# Altium project Water System.PrjPcb
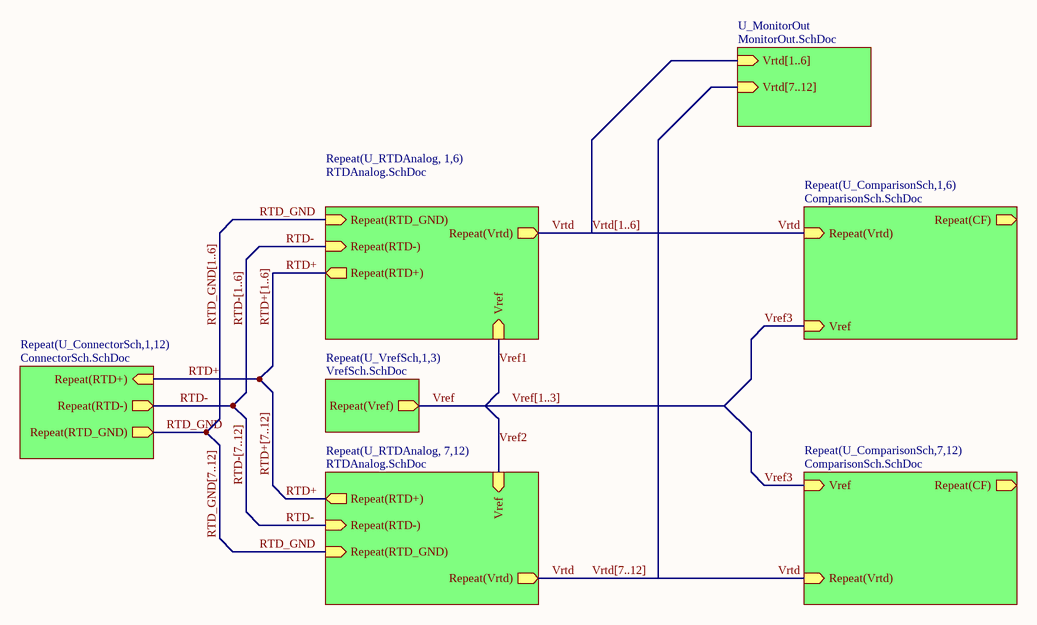
[diagram p0: MainSch.SchDoc]
7 sheets, 170 parts. Net scope: hierarchical (ports join the sheet entries above them; power ports are global).
Sheets:
  MainSch.SchDoc
    U_RTDAnalog1 = RTDAnalog.SchDoc
    U_RTDAnalog2 = RTDAnalog.SchDoc
    U_RTDAnalog3 = RTDAnalog.SchDoc
    U_RTDAnalog4 = RTDAnalog.SchDoc
    U_RTDAnalog5 = RTDAnalog.SchDoc
    U_RTDAnalog6 = RTDAnalog.SchDoc
    U_VrefSch1 = VrefSch.SchDoc
    U_VrefSch2 = VrefSch.SchDoc
    U_VrefSch3 = VrefSch.SchDoc
    U_RTDAnalog7 = RTDAnalog.SchDoc
    U_RTDAnalog8 = RTDAnalog.SchDoc
    U_RTDAnalog9 = RTDAnalog.SchDoc
    U_RTDAnalog10 = RTDAnalog.SchDoc
    U_RTDAnalog11 = RTDAnalog.SchDoc
    U_RTDAnalog12 = RTDAnalog.SchDoc
    U_ConnectorSch1 = ConnectorSch.SchDoc
    U_ConnectorSch2 = ConnectorSch.SchDoc
    U_ConnectorSch3 = ConnectorSch.SchDoc
    U_ConnectorSch4 = ConnectorSch.SchDoc
    U_ConnectorSch5 = ConnectorSch.SchDoc
    U_ConnectorSch6 = ConnectorSch.SchDoc
    U_ConnectorSch7 = ConnectorSch.SchDoc
    U_ConnectorSch8 = ConnectorSch.SchDoc
    U_ConnectorSch9 = ConnectorSch.SchDoc
    U_ConnectorSch10 = ConnectorSch.SchDoc
    U_ConnectorSch11 = ConnectorSch.SchDoc
    U_ConnectorSch12 = ConnectorSch.SchDoc
    U_ComparisonSch1 = ComparisonSch.SchDoc
    U_ComparisonSch2 = ComparisonSch.SchDoc
    U_ComparisonSch3 = ComparisonSch.SchDoc
    U_ComparisonSch4 = ComparisonSch.SchDoc
    U_ComparisonSch5 = ComparisonSch.SchDoc
    U_ComparisonSch6 = ComparisonSch.SchDoc
    U_ComparisonSch7 = ComparisonSch.SchDoc
    U_ComparisonSch8 = ComparisonSch.SchDoc
    U_ComparisonSch9 = ComparisonSch.SchDoc
    U_ComparisonSch10 = ComparisonSch.SchDoc
    U_ComparisonSch11 = ComparisonSch.SchDoc
    U_ComparisonSch12 = ComparisonSch.SchDoc
    U_MonitorOut = MonitorOut.SchDoc
  12VSupply.SchDoc

## Sheet MainSch.SchDoc
size A

### Sub-sheets
Repeat(U_ComparisonSch,1,6) = ComparisonSch.SchDoc: Vref (in), Repeat(Vrtd) (in), Repeat(CF) (out)
Repeat(U_ComparisonSch,7,12) = ComparisonSch.SchDoc: Vref (in), Repeat(Vrtd) (in), Repeat(CF) (out)
Repeat(U_ConnectorSch,1,12) = ConnectorSch.SchDoc: Repeat(RTD+) (in), Repeat(RTD-) (out), Repeat(RTD_GND) (out)
Repeat(U_RTDAnalog, 1,6) = RTDAnalog.SchDoc: Repeat(RTD+) (out), Vref (in), Repeat(RTD_GND) (in), Repeat(Vrtd) (out), Repeat(RTD-) (in)
Repeat(U_RTDAnalog, 7,12) = RTDAnalog.SchDoc: Repeat(RTD+) (out), Vref (in), Repeat(RTD_GND) (in), Repeat(Vrtd) (out), Repeat(RTD-) (in)
Repeat(U_VrefSch,1,3) = VrefSch.SchDoc: Repeat(Vref) (out)
U_MonitorOut = MonitorOut.SchDoc: Vrtd[1..6] (in), Vrtd[7..12] (in)

### Nets
RTD+: sheet Repeat(U_RTDAnalog, 1,6)/Repeat(RTD+), sheet Repeat(U_RTDAnalog, 7,12)/Repeat(RTD+), sheet Repeat(U_ConnectorSch,1,12)/Repeat(RTD+)
RTD-: sheet Repeat(U_RTDAnalog, 1,6)/Repeat(RTD-), sheet Repeat(U_RTDAnalog, 7,12)/Repeat(RTD-), sheet Repeat(U_ConnectorSch,1,12)/Repeat(RTD-)
RTD_GND: sheet Repeat(U_RTDAnalog, 1,6)/Repeat(RTD_GND), sheet Repeat(U_RTDAnalog, 7,12)/Repeat(RTD_GND), sheet Repeat(U_ConnectorSch,1,12)/Repeat(RTD_GND)  [also labelled RTD_GND[7..12]]
Vref: sheet Repeat(U_VrefSch,1,3)/Repeat(Vref)
Vref3: sheet Repeat(U_ComparisonSch,1,6)/Vref, sheet Repeat(U_ComparisonSch,7,12)/Vref
Vrtd: sheet Repeat(U_RTDAnalog, 1,6)/Repeat(Vrtd), sheet Repeat(U_RTDAnalog, 7,12)/Repeat(Vrtd), sheet Repeat(U_ComparisonSch,1,6)/Repeat(Vrtd), sheet Repeat(U_ComparisonSch,7,12)/Repeat(Vrtd)

### Buses and harness runs
bus RTD+[1..6]
bus RTD+[7..12]
bus RTD-[1..6]
bus RTD-[7..12]
bus RTD_GND[1..6]
bus Vref[1..3]
bus Vrtd[1..6] = sheet U_MonitorOut/Vrtd[1..6]
bus Vrtd[7..12] = sheet U_MonitorOut/Vrtd[7..12]

## Sheet RTDAnalog.SchDoc
size A
Used 12 times, as channels U_RTDAnalog1, U_RTDAnalog2, U_RTDAnalog3, U_RTDAnalog4, U_RTDAnalog5, U_RTDAnalog6, U_RTDAnalog7, U_RTDAnalog8, U_RTDAnalog9, U_RTDAnalog10, U_RTDAnalog11, U_RTDAnalog12. Parts and nets are listed once, with the designators drawn on the sheet.
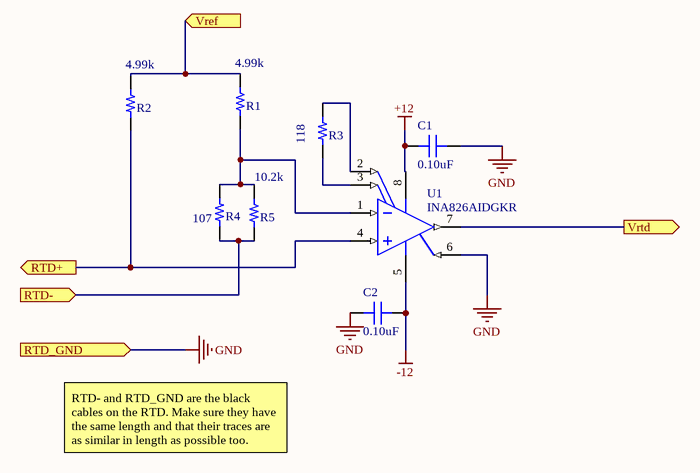
[diagram p1: RTDAnalog.SchDoc]

### Parts
C1  0.10uF  [CAP 0402/1005]
C2  0.10uF  [CAP 0402/1005]
R1  4.99k  [RES 0805/2012]
R2  4.99k  [RES 0805/2012]
R3  118  [RES 0805/2012]
R4  107  [RES 0805/2012]
R5  10.2k  [RES 0805/2012]
U1  INA826AIDGKR  [DGK0008A_N]

### Ports
RTD+ (out), RTD- (in), RTD_GND (in), Vref (in), Vrtd (out)

### Nets
+12: C1.1 U1.8(VS+)
-12: C2.2 U1.5(VS-)
GND: C1.2 C2.1 U1.6(REF) ; port RTD_GND
RTD+: R2.1 U1.4(IN+) ; port RTD+
RTD-: R4.1 R5.1 ; port RTD-
Vref: R1.2 R2.2 ; port Vref
Vrtd: U1.7(VOUT) ; port Vrtd
NetR1_1: R1.1 R4.2 R5.2 U1.1(IN-)
NetR3_1: R3.1 U1.3(RG)
NetR3_2: R3.2 U1.2(RG)

### Channels
U_RTDAnalog1: designators end in _U_RTDAnalog1; ports RTD+=RTD+1 RTD-=RTD-1 RTD_GND=RTD_GND1 Vref=Vref1 Vrtd=Vrtd1
U_RTDAnalog2: designators end in _U_RTDAnalog2; ports RTD+=RTD+2 RTD-=RTD-2 RTD_GND=RTD_GND1 Vref=Vref1 Vrtd=Vrtd2
U_RTDAnalog3: designators end in _U_RTDAnalog3; ports RTD+=RTD+3 RTD-=RTD-3 RTD_GND=RTD_GND1 Vref=Vref1 Vrtd=Vrtd3
U_RTDAnalog4: designators end in _U_RTDAnalog4; ports RTD+=RTD+4 RTD-=RTD-4 RTD_GND=RTD_GND1 Vref=Vref1 Vrtd=Vrtd4
U_RTDAnalog5: designators end in _U_RTDAnalog5; ports RTD+=RTD+5 RTD-=RTD-5 RTD_GND=RTD_GND1 Vref=Vref1 Vrtd=Vrtd5
U_RTDAnalog6: designators end in _U_RTDAnalog6; ports RTD+=RTD+6 RTD-=RTD-6 RTD_GND=RTD_GND1 Vref=Vref1 Vrtd=Vrtd6
U_RTDAnalog7: designators end in _U_RTDAnalog7; ports RTD+=RTD+7 RTD-=RTD-7 RTD_GND=RTD_GND1 Vref=Vref2 Vrtd=Vrtd7
U_RTDAnalog8: designators end in _U_RTDAnalog8; ports RTD+=RTD+8 RTD-=RTD-8 RTD_GND=RTD_GND1 Vref=Vref2 Vrtd=Vrtd8
U_RTDAnalog9: designators end in _U_RTDAnalog9; ports RTD+=RTD+9 RTD-=RTD-9 RTD_GND=RTD_GND1 Vref=Vref2 Vrtd=Vrtd9
U_RTDAnalog10: designators end in _U_RTDAnalog10; ports RTD+=RTD+10 RTD-=RTD-10 RTD_GND=RTD_GND1 Vref=Vref2 Vrtd=Vrtd10
U_RTDAnalog11: designators end in _U_RTDAnalog11; ports RTD+=RTD+11 RTD-=RTD-11 RTD_GND=RTD_GND1 Vref=Vref2 Vrtd=Vrtd11
U_RTDAnalog12: designators end in _U_RTDAnalog12; ports RTD+=RTD+12 RTD-=RTD-12 RTD_GND=RTD_GND1 Vref=Vref2 Vrtd=Vrtd12

### Notes on the sheet
- RTD- and RTD_GND are the black cables on the RTD. Make sure they have the same length and that their traces are as similar in length as possible too.

### Library data of the parts
C1 C2 = GRM155R71C104JA88D: CAP CER 0.1UF 16V X7R 0402; Manufacturer: Murata Electronics North America; TemperatureRange: -55C ~ 125C; Tolerance: 5%; Value: 0.10uF; Part Number: GRM155R71C104JA88D; PartId: 12366; Supplier 1: Digi-Key; Supplier Part Number 1: 490-6327-2-ND; ComponentLink1Description: Datasheet; ComponentLink1URL: http://www.murata.com/~/media/webrenewal/support/library/catalog/products/capacitor/mlcc/c02e.pdf; ComponentLink2Description: Digi-Key Listing; ComponentLink2URL: https://www.digikey.com/product-detail/en/murata-electronics-north-america/GRM155R71C104JA88D/490-6327-2-ND/2610891; TemperatureCoefficient: X7R; Voltage: 16V; Price: 0.0046; Device Package: 0402 (1005 Metric)
R1 R2 = ERA-6AEB4991V: RES SMD 4.99K OHM 0.1% 1/8W 0805; Manufacturer: Panasonic Electronic Components; TemperatureRange: -55C ~ 155C; TemperatureCoefficient: 25ppm/C; PowerRating: 0.125W, 1/8W; Value: 4.99k; Part Number: ERA-6AEB4991V; PartId: 2457; Supplier 1: Digi-Key; Supplier Part Number 1: P4.99KDATR-ND; ComponentLink1Description: Datasheet; ComponentLink1URL: http://industrial.panasonic.com/lecs/www-data/pdf/AOA0000/AOA0000CE26.pdf; ComponentLink2Description: Digi-Key listing; ComponentLink2URL: http://digikey.com/product-detail/en/ERA-6AEB4991V/P4.99KDATR-ND/2025726; Tolerance: 0.1%; Price: 0.0653; Type: Thin Film; Device Package: 0805 (2012 Metric)
R3 = ERA-6AEB1180V: RES SMD 118 OHM 0.1% 1/8W 0805; Manufacturer: Panasonic Electronic Components; TemperatureRange: -55C ~ 155C; TemperatureCoefficient: 25ppm/C; PowerRating: 0.125W, 1/8W; Value: 118; Part Number: ERA-6AEB1180V; PartId: 2788; Supplier 1: Digi-Key; Supplier Part Number 1: P118DATR-ND; ComponentLink1Description: Datasheet; ComponentLink1URL: http://industrial.panasonic.com/lecs/www-data/pdf/AOA0000/AOA0000CE26.pdf; ComponentLink2Description: Digi-Key listing; ComponentLink2URL: http://digikey.com/product-detail/en/ERA-6AEB1180V/P118DATR-ND/2025579; Tolerance: 0.1%; Price: 0.0653; Type: Thin Film; Device Package: 0805 (2012 Metric)
R4 = ERA-6AEB1070V: RES SMD 107 OHM 0.1% 1/8W 0805; Manufacturer: Panasonic Electronic Components; TemperatureRange: -55C ~ 155C; TemperatureCoefficient: 25ppm/C; PowerRating: 0.125W, 1/8W; Value: 107; Part Number: ERA-6AEB1070V; PartId: 2810; Supplier 1: Digi-Key; Supplier Part Number 1: P107DATR-ND; ComponentLink1Description: Datasheet; ComponentLink1URL: http://industrial.panasonic.com/lecs/www-data/pdf/AOA0000/AOA0000CE26.pdf; ComponentLink2Description: Digi-Key listing; ComponentLink2URL: http://digikey.com/product-detail/en/ERA-6AEB1070V/P107DATR-ND/2025576; Tolerance: 0.1%; Price: 0.0653; Type: Thin Film; Device Package: 0805 (2012 Metric)
R5 = ERA-6AEB1022V: RES SMD 10.2K OHM 0.1% 1/8W 0805; Manufacturer: Panasonic Electronic Components; TemperatureRange: -55C ~ 155C; TemperatureCoefficient: 25ppm/C; PowerRating: 0.125W, 1/8W; Value: 10.2k; Part Number: ERA-6AEB1022V; PartId: 2668; Supplier 1: Digi-Key; Supplier Part Number 1: P10.2KDATR-ND; ComponentLink1Description: Datasheet; ComponentLink1URL: http://industrial.panasonic.com/lecs/www-data/pdf/AOA0000/AOA0000CE26.pdf; ComponentLink2Description: Digi-Key listing; ComponentLink2URL: http://digikey.com/product-detail/en/ERA-6AEB1022V/P10.2KDATR-ND/2025754; Tolerance: 0.1%; Price: 0.0653; Type: Thin Film; Device Package: 0805 (2012 Metric)
U1 = CMP-0944-00060-2: Precision, 200-uA Supply Current, 36-V Supply Instrumentation Amplifier, -40 to 125 degC, 8-pin SOP (DGK8), Green (RoHS & no Sb/Br); Manufacturer: Texas Instruments; Output Offset (+/-)(Max)(uV): 700; Input Offset Drift (+/-)(Max)(uV/Degrees Celsius): 2; Vs(Max)(V): 36; Non-Linearity (+/-)(Max)(%): 0.0005; Input Offset (+/-)(Max)(uV): 150; Output Offset Drift (+/-)(Max)(uV/Degrees Celsius): 10; Gain(V/V): 1 to 1000; CMRR(Min)(dB): 84; Noise at 1kHz(Typ)(nV/rt(Hz)): 18; Vs(Min)(V): 2.7; SubFamily: Single Supply; Number of Channels: 1; Input Bias Current (+/-)(Max)(nA): 65; Quiescent Current (+/-)(Typ)(mA): 0.2; ComponentLink1Description: Manufacturer URL; PartNumber: INA826AIDGKR; ComponentLink2URL: http://www.ti.com/general/docs/lit/getliterature.tsp?genericPartNumber=INA826&fileType=pdf; Code_JEDEC: MO-187; Eco-Plan: Green (RoHS & no Sb/Br); ComponentLink3URL: http://www.ti.com/litv/pdf/mpds028d; Mounting Technology: Surface Mount; ComponentLink3Description: Package Specification; PackageReference: DGK0008A; ComponentLink2Description: Datasheet; DatasheetVersion: SBOS562E; ComponentLink1URL: http://www.ti.com/; PackageDescription: 8-Pin Thin Small Outline, Body 3 x 3 mm, Pitch 0.65 mm; PackageVersion: 4073329/E, 05/2006

## Sheet VrefSch.SchDoc
size A
Used 3 times, as channels U_VrefSch1, U_VrefSch2, U_VrefSch3. Parts and nets are listed once, with the designators drawn on the sheet.
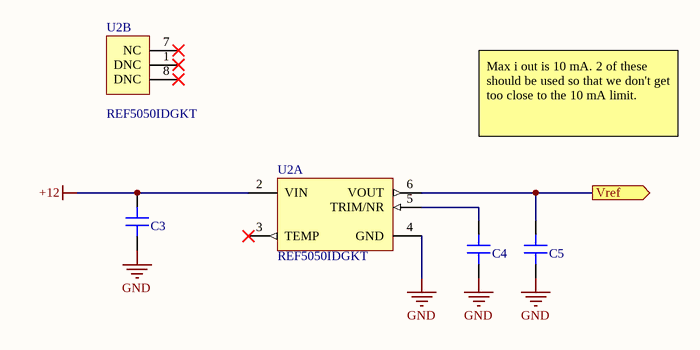
[diagram p2: VrefSch.SchDoc]

### Parts
C3  1uF  [CAP 0805/2012]  (value not drawn)
C4  1uF  [CAP 0805/2012]  (value not drawn)
C5  1uF  [CAP 0805/2012]  (value not drawn)
U2  REF5050IDGKT  [DGK0008A_N]  (parts A,B of 2)

### Ports
Vref (out)

### Nets
+12: C3.2 U2.2(VIN)
GND: C3.1 C4.1 C5.1 U2.4(GND)
Vref: C5.2 U2.6(VOUT) ; port Vref
NetC4_2: C4.2 U2.5(TRIM/NR)

Not connected (* = marked no-connect by the designer): U2 1(DNC)* 3(TEMP)* 7(NC)* 8(DNC)*

### Channels
U_VrefSch1: designators end in _U_VrefSch1; ports Vref=Vref1
U_VrefSch2: designators end in _U_VrefSch2; ports Vref=Vref2
U_VrefSch3: designators end in _U_VrefSch3; ports Vref=Vref3

### Notes on the sheet
- Max i out is 10 mA. 2 of these should be used so that we don't get too close to the 10 mA limit.

### Library data of the parts
C3-C5 = C0805C105J3RACTU: CAP CER 1UF 25V X7R 0805; Manufacturer: Kemet; TemperatureRange: -55C ~ 125C; Tolerance: 5%; Value: 1uF; Part Number: C0805C105J3RACTU; PartId: 6145; Supplier 1: Digi-Key; Supplier Part Number 1: 399-10060-2-ND; ComponentLink1Description: Datasheet; ComponentLink1URL: http://www.kemet.com/docfinder?Partnumber=C0805C105J3RACTU; ComponentLink2Description: Digi-Key listing; ComponentLink2URL: http://digikey.com/product-detail/en/C0805C105J3RACTU/399-10060-2-ND/2211758; TemperatureCoefficient: X7R; Voltage: 25V; Price: 0.355; Type: -; Device Package: 0805 (2012 Metric)
U2 = CMP-0367-00254-2: Low Noise, Very Low Drift, Precision Voltage Reference, -40 to 125 degC, 8-pin VSSOP (DGK), Green (RoHS & no Sb/Br); Manufacturer: Texas Instruments; VI(Min)(V): 5.2; Rating: Catalog; Initial Accuracy @ 25/deg C(%): 0.05; VO(V): 5; Iq(Max)(uA): 1000; SubFamily: Series Voltage Reference; Temp Coeff(Max)(ppm/ degree C): 3; Iout/Iz(Max)(mA): 10; VI(Max)(V): 18; ComponentLink1Description: Manufacturer URL; PartNumber: REF5050IDGKT; PackageVersion: 4073329/E; Code_JEDEC: MO-187; Eco-Plan: Green (RoHS & no Sb/Br); ComponentLink2Description: Datasheet; PackageReference: DGK0008A; ComponentLink2URL: http://www.ti.com/general/docs/lit/getliterature.tsp?genericPartNumber=REF5050&fileType=pdf; ComponentLink3URL: http://www.ti.com/litv/pdf/mpds028d; ComponentLink1URL: http://www.ti.com/; PackageDescription: 8-Pin Thin Small Outline Package 3 x 3 mm Body ,0.65 mm Pitch; ComponentLink3Description: Package Specification; Mounting Technology: Surface Mount; DatasheetVersion: SBOS410E

## Sheet ConnectorSch.SchDoc
size A
Used 12 times, as channels U_ConnectorSch1, U_ConnectorSch2, U_ConnectorSch3, U_ConnectorSch4, U_ConnectorSch5, U_ConnectorSch6, U_ConnectorSch7, U_ConnectorSch8, U_ConnectorSch9, U_ConnectorSch10, U_ConnectorSch11, U_ConnectorSch12. Parts and nets are listed once, with the designators drawn on the sheet.
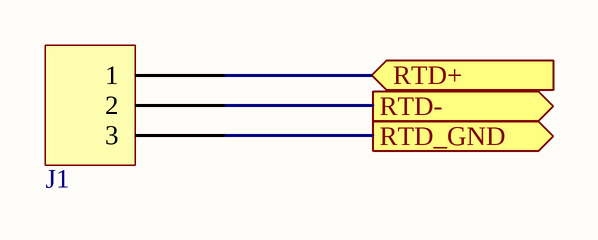
[diagram p3: ConnectorSch.SchDoc]

### Parts
J1  0022272031  [MOLEX KK 0022272031]  (value not drawn)

### Ports
RTD+ (in), RTD- (out), RTD_GND (out)

### Nets
RTD+: J1.1 ; port RTD+
RTD-: J1.2 ; port RTD-
RTD_GND: J1.3 ; port RTD_GND

### Channels
U_ConnectorSch1: designators end in _U_ConnectorSch1; ports RTD+=RTD+1 RTD-=RTD-1 RTD_GND=RTD_GND1
U_ConnectorSch2: designators end in _U_ConnectorSch2; ports RTD+=RTD+2 RTD-=RTD-2 RTD_GND=RTD_GND1
U_ConnectorSch3: designators end in _U_ConnectorSch3; ports RTD+=RTD+3 RTD-=RTD-3 RTD_GND=RTD_GND1
U_ConnectorSch4: designators end in _U_ConnectorSch4; ports RTD+=RTD+4 RTD-=RTD-4 RTD_GND=RTD_GND1
U_ConnectorSch5: designators end in _U_ConnectorSch5; ports RTD+=RTD+5 RTD-=RTD-5 RTD_GND=RTD_GND1
U_ConnectorSch6: designators end in _U_ConnectorSch6; ports RTD+=RTD+6 RTD-=RTD-6 RTD_GND=RTD_GND1
U_ConnectorSch7: designators end in _U_ConnectorSch7; ports RTD+=RTD+7 RTD-=RTD-7 RTD_GND=RTD_GND1
U_ConnectorSch8: designators end in _U_ConnectorSch8; ports RTD+=RTD+8 RTD-=RTD-8 RTD_GND=RTD_GND1
U_ConnectorSch9: designators end in _U_ConnectorSch9; ports RTD+=RTD+9 RTD-=RTD-9 RTD_GND=RTD_GND1
U_ConnectorSch10: designators end in _U_ConnectorSch10; ports RTD+=RTD+10 RTD-=RTD-10 RTD_GND=RTD_GND1
U_ConnectorSch11: designators end in _U_ConnectorSch11; ports RTD+=RTD+11 RTD-=RTD-11 RTD_GND=RTD_GND1
U_ConnectorSch12: designators end in _U_ConnectorSch12; ports RTD+=RTD+12 RTD-=RTD-12 RTD_GND=RTD_GND1

### Library data of the parts
J1 = 0022272031: CONN HEADER 3POS .100 VERT TIN; Manufacturer: Molex, LLC; Pitch: 0.100" (2.54mm); Number Of Positions: 3; Part Number: 0022272031; PartId: 9720; Supplier 1: Digi-Key; Supplier Part Number 1: WM4112-ND; ComponentLink1Description: Datasheet; ComponentLink1URL: http://www.molex.com/pdm_docs/sd/022272031_sd.pdf; ComponentLink2Description: Digi-Key Listing; ComponentLink2URL: http://www.digikey.com/product-search/en?keywords=22-27-2031; Price: 0.35; Type: Header, Unshrouded; Contact Finish: Tin; Fastening Type: Friction Lock; Number Of Rows: 1; Colour: Natural; Series: KK 6410

## Sheet ComparisonSch.SchDoc
size A
Used 12 times, as channels U_ComparisonSch1, U_ComparisonSch2, U_ComparisonSch3, U_ComparisonSch4, U_ComparisonSch5, U_ComparisonSch6, U_ComparisonSch7, U_ComparisonSch8, U_ComparisonSch9, U_ComparisonSch10, U_ComparisonSch11, U_ComparisonSch12. Parts and nets are listed once, with the designators drawn on the sheet.
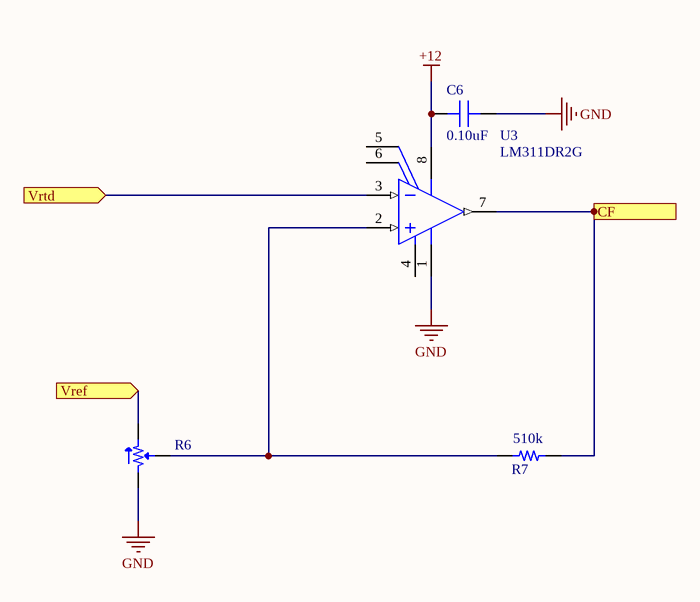
[diagram p4: ComparisonSch.SchDoc]

### Parts
C6  0.10uF  [CAP 0402/1005]
R6  20k  [POT MODEL91A]  (value not drawn)
R7  510k  [RES 1206/3216]
U3  LM311DR2G  [ONSC-SOIC-8-751-07_V]

### Ports
CF (out), Vref (in), Vrtd (in)

### Nets
+12: C6.1 U3.8(VCC)
GND: C6.2 R6.1 U3.1(GND)
CF: R7.2 U3.7(OUT) ; port CF
Vref: R6.3 ; port Vref
Vrtd: U3.3(IN-) ; port Vrtd
NetR6_2: R6.2 R7.1 U3.2(IN+)

Not connected (* = marked no-connect by the designer): U3 4(VEE) 5(BALANCE) 6(BALANCE/STROBE)

### Channels
U_ComparisonSch1: designators end in _U_ComparisonSch1; ports CF=NetR7_U_ComparisonSch1_2 Vref=Vref3 Vrtd=Vrtd1
U_ComparisonSch2: designators end in _U_ComparisonSch2; ports CF=NetR7_U_ComparisonSch2_2 Vref=Vref3 Vrtd=Vrtd2
U_ComparisonSch3: designators end in _U_ComparisonSch3; ports CF=NetR7_U_ComparisonSch3_2 Vref=Vref3 Vrtd=Vrtd3
U_ComparisonSch4: designators end in _U_ComparisonSch4; ports CF=NetR7_U_ComparisonSch4_2 Vref=Vref3 Vrtd=Vrtd4
U_ComparisonSch5: designators end in _U_ComparisonSch5; ports CF=NetR7_U_ComparisonSch5_2 Vref=Vref3 Vrtd=Vrtd5
U_ComparisonSch6: designators end in _U_ComparisonSch6; ports CF=NetR7_U_ComparisonSch6_2 Vref=Vref3 Vrtd=Vrtd6
U_ComparisonSch7: designators end in _U_ComparisonSch7; ports CF=NetR7_U_ComparisonSch7_2 Vref=Vref3 Vrtd=Vrtd7
U_ComparisonSch8: designators end in _U_ComparisonSch8; ports CF=NetR7_U_ComparisonSch8_2 Vref=Vref3 Vrtd=Vrtd8
U_ComparisonSch9: designators end in _U_ComparisonSch9; ports CF=NetR7_U_ComparisonSch9_2 Vref=Vref3 Vrtd=Vrtd9
U_ComparisonSch10: designators end in _U_ComparisonSch10; ports CF=NetR7_U_ComparisonSch10_2 Vref=Vref3 Vrtd=Vrtd10
U_ComparisonSch11: designators end in _U_ComparisonSch11; ports CF=NetR7_U_ComparisonSch11_2 Vref=Vref3 Vrtd=Vrtd11
U_ComparisonSch12: designators end in _U_ComparisonSch12; ports CF=NetR7_U_ComparisonSch12_2 Vref=Vref3 Vrtd=Vrtd12

### Library data of the parts
C6 = GRM155R71C104JA88D: as C1 on sheet RTDAnalog; Value: 0.10uF; Part Number: GRM155R71C104JA88D; PartId: 12366; Supplier 1: Digi-Key; Supplier Part Number 1: 490-6327-2-ND; ComponentLink1Description: Datasheet; ComponentLink1URL: http://www.murata.com/~/media/webrenewal/support/library/catalog/products/capacitor/mlcc/c02e.pdf; ComponentLink2Description: Digi-Key Listing; ComponentLink2URL: https://www.digikey.com/product-detail/en/murata-electronics-north-america/GRM155R71C104JA88D/490-6327-2-ND/2610891; TemperatureCoefficient: X7R; Voltage: 16V; Price: 0.0046; Device Package: 0402 (1005 Metric)
R6 = 91AR20KLF: TRIMMER 20K OHM 3/8" CERMET TH; Manufacturer: TT Electronics/BI; Tolerance: 20%; PowerRating: 0.5W, 1/2W; Number Of Turns: Single; Adjustment Type: Top Adjustment; Value: 20k; Part Number: 91AR20KLF; PartId: 7167; Supplier 1: Digi-Key; Supplier Part Number 1: 987-1170-ND; ComponentLink1Description: Datasheet; ComponentLink1URL: http://www.bitechnologies.com/pdfs/91.pdf; ComponentLink2Description: Digi-Key Listing; ComponentLink2URL: http://www.digikey.ca/product-detail/en/91AR20KLF/987-1170-ND/2408748; Price: 2.25; Type: Through Hole
R7 = ERJ-8GEYJ514V: RES SMD 510K OHM 5% 1/4W 1206; Manufacturer: Panasonic Electronic Components; TemperatureRange: -55C ~ 155C; TemperatureCoefficient: 200ppm/C; PowerRating: 0.25W, 1/4W; Value: 510k; Part Number: ERJ-8GEYJ514V; PartId: 11855; Supplier 1: Digi-Key; Supplier Part Number 1: P510KETR-ND; ComponentLink1Description: Datasheet; ComponentLink1URL: http://industrial.panasonic.com/www-cgi/jvcr13pz.cgi?E+PZ+3+AOA0001+ERJ8GEYJ514V+7+WW; ComponentLink2Description: Digi-Key Listing; ComponentLink2URL: https://www.digikey.com/product-detail/en/panasonic-electronic-components/ERJ-8GEYJ514V/P510KETR-ND/21336; Tolerance: 5%; Price: 0.0045; Device Package: 1206 (3216 Metric)
U3 = CMP-1305-00058-1: Single Comparator, 5 to 30 V, 0 to 70 degC, 8-Pin SOIC, Pb-Free, Tape and Reel; Manufacturer: On Semiconductor; VCC Max (V): 30; VCC Min (V): 5; ICC Typ (mA): 2.4; ComponentLink3Description: Package Specification; ComponentLink1URL: http://www.onsemi.com/; ComponentLink1Description: Manufacturer URL; Mounting Technology: Surface Mount; PackageDescription: 8-Pin Small Outline Integrated Circuit, Body 4.9 x 3.9 mm, Pitch 1.27 mm; ComponentLink2Description: Datasheet; RoHS: TRUE; ComponentLink2URL: http://www.onsemi.com/pub_link/Collateral/LM211-D.PDF; PackageVersion: Rev. AK, 02/2011; PackageReference: SOIC-8-751-07; DatasheetVersion: Rev. 6; Packing: Tape and Reel; ComponentLink3URL: http://www.onsemi.com/pub_link/Collateral/751-07.PDF; PartNumber: LM311DR2G

## Sheet MonitorOut.SchDoc
size A
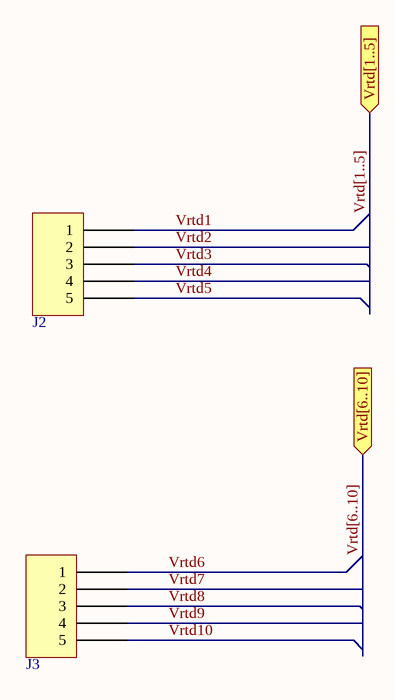
[diagram p5: MonitorOut.SchDoc]

### Parts
J2  0022272051  [MOLEX KK 0022272051]  (value not drawn)
J3  0022272051  [MOLEX KK 0022272051]  (value not drawn)

### Ports
Vrtd[1..5] (in), Vrtd[6..10] (in)

### Nets
Vrtd1: J2.1  [also labelled Vrtd[1..5]]
Vrtd2: J2.2
Vrtd3: J2.3
Vrtd4: J2.4
Vrtd5: J2.5
Vrtd6: J3.1  [also labelled Vrtd[6..10]]
Vrtd7: J3.2
Vrtd8: J3.3
Vrtd9: J3.4
Vrtd10: J3.5

### Library data of the parts
J2 J3 = 0022272051: CONN HEADER 5POS .100 VERT TIN; Manufacturer: Molex, LLC; Pitch: 0.100" (2.54mm); Number Of Positions: 5; Part Number: 0022272051; PartId: 9722; Supplier 1: Digi-Key; Supplier Part Number 1: WM4114-ND; ComponentLink1Description: Datasheet; ComponentLink1URL: http://www.molex.com/pdm_docs/sd/022272051_sd.pdf; ComponentLink2Description: Digi-Key Listing; ComponentLink2URL: http://www.digikey.com/product-search/en?keywords=22-27-2051; Price: 0.44; Type: Header, Unshrouded; Contact Finish: Tin; Fastening Type: Friction Lock; Number Of Rows: 1; Colour: Natural; Series: KK 6410

## Sheet 12VSupply.SchDoc
size A

## Nets that join several sheets
+12: U_RTDAnalog1 (C1_U_RTDAnalog1.1 U1_U_RTDAnalog1.8), U_RTDAnalog2 (C1_U_RTDAnalog2.1 U1_U_RTDAnalog2.8), U_RTDAnalog3 (C1_U_RTDAnalog3.1 U1_U_RTDAnalog3.8), U_RTDAnalog4 (C1_U_RTDAnalog4.1 U1_U_RTDAnalog4.8), U_RTDAnalog5 (C1_U_RTDAnalog5.1 U1_U_RTDAnalog5.8), U_RTDAnalog6 (C1_U_RTDAnalog6.1 U1_U_RTDAnalog6.8), U_VrefSch1 (C3_U_VrefSch1.2 U2_U_VrefSch1.2), U_VrefSch2 (C3_U_VrefSch2.2 U2_U_VrefSch2.2), U_VrefSch3 (C3_U_VrefSch3.2 U2_U_VrefSch3.2), U_RTDAnalog7 (C1_U_RTDAnalog7.1 U1_U_RTDAnalog7.8), U_RTDAnalog8 (C1_U_RTDAnalog8.1 U1_U_RTDAnalog8.8), U_RTDAnalog9 (C1_U_RTDAnalog9.1 U1_U_RTDAnalog9.8), U_RTDAnalog10 (C1_U_RTDAnalog10.1 U1_U_RTDAnalog10.8), U_RTDAnalog11 (C1_U_RTDAnalog11.1 U1_U_RTDAnalog11.8), U_RTDAnalog12 (C1_U_RTDAnalog12.1 U1_U_RTDAnalog12.8), U_ComparisonSch1 (C6_U_ComparisonSch1.1 U3_U_ComparisonSch1.8), U_ComparisonSch2 (C6_U_ComparisonSch2.1 U3_U_ComparisonSch2.8), U_ComparisonSch3 (C6_U_ComparisonSch3.1 U3_U_ComparisonSch3.8), U_ComparisonSch4 (C6_U_ComparisonSch4.1 U3_U_ComparisonSch4.8), U_ComparisonSch5 (C6_U_ComparisonSch5.1 U3_U_ComparisonSch5.8), U_ComparisonSch6 (C6_U_ComparisonSch6.1 U3_U_ComparisonSch6.8), U_ComparisonSch7 (C6_U_ComparisonSch7.1 U3_U_ComparisonSch7.8), U_ComparisonSch8 (C6_U_ComparisonSch8.1 U3_U_ComparisonSch8.8), U_ComparisonSch9 (C6_U_ComparisonSch9.1 U3_U_ComparisonSch9.8), U_ComparisonSch10 (C6_U_ComparisonSch10.1 U3_U_ComparisonSch10.8), U_ComparisonSch11 (C6_U_ComparisonSch11.1 U3_U_ComparisonSch11.8), U_ComparisonSch12 (C6_U_ComparisonSch12.1 U3_U_ComparisonSch12.8)
-12: U_RTDAnalog1 (C2_U_RTDAnalog1.2 U1_U_RTDAnalog1.5), U_RTDAnalog2 (C2_U_RTDAnalog2.2 U1_U_RTDAnalog2.5), U_RTDAnalog3 (C2_U_RTDAnalog3.2 U1_U_RTDAnalog3.5), U_RTDAnalog4 (C2_U_RTDAnalog4.2 U1_U_RTDAnalog4.5), U_RTDAnalog5 (C2_U_RTDAnalog5.2 U1_U_RTDAnalog5.5), U_RTDAnalog6 (C2_U_RTDAnalog6.2 U1_U_RTDAnalog6.5), U_RTDAnalog7 (C2_U_RTDAnalog7.2 U1_U_RTDAnalog7.5), U_RTDAnalog8 (C2_U_RTDAnalog8.2 U1_U_RTDAnalog8.5), U_RTDAnalog9 (C2_U_RTDAnalog9.2 U1_U_RTDAnalog9.5), U_RTDAnalog10 (C2_U_RTDAnalog10.2 U1_U_RTDAnalog10.5), U_RTDAnalog11 (C2_U_RTDAnalog11.2 U1_U_RTDAnalog11.5), U_RTDAnalog12 (C2_U_RTDAnalog12.2 U1_U_RTDAnalog12.5)
RTD_GND1: U_RTDAnalog1 (C1_U_RTDAnalog1.2 C2_U_RTDAnalog1.1 U1_U_RTDAnalog1.6), U_RTDAnalog2 (C1_U_RTDAnalog2.2 C2_U_RTDAnalog2.1 U1_U_RTDAnalog2.6), U_RTDAnalog3 (C1_U_RTDAnalog3.2 C2_U_RTDAnalog3.1 U1_U_RTDAnalog3.6), U_RTDAnalog4 (C1_U_RTDAnalog4.2 C2_U_RTDAnalog4.1 U1_U_RTDAnalog4.6), U_RTDAnalog5 (C1_U_RTDAnalog5.2 C2_U_RTDAnalog5.1 U1_U_RTDAnalog5.6), U_RTDAnalog6 (C1_U_RTDAnalog6.2 C2_U_RTDAnalog6.1 U1_U_RTDAnalog6.6), U_VrefSch1 (C3_U_VrefSch1.1 C4_U_VrefSch1.1 C5_U_VrefSch1.1 U2_U_VrefSch1.4), U_VrefSch2 (C3_U_VrefSch2.1 C4_U_VrefSch2.1 C5_U_VrefSch2.1 U2_U_VrefSch2.4), U_VrefSch3 (C3_U_VrefSch3.1 C4_U_VrefSch3.1 C5_U_VrefSch3.1 U2_U_VrefSch3.4), U_RTDAnalog7 (C1_U_RTDAnalog7.2 C2_U_RTDAnalog7.1 U1_U_RTDAnalog7.6), U_RTDAnalog8 (C1_U_RTDAnalog8.2 C2_U_RTDAnalog8.1 U1_U_RTDAnalog8.6), U_RTDAnalog9 (C1_U_RTDAnalog9.2 C2_U_RTDAnalog9.1 U1_U_RTDAnalog9.6), U_RTDAnalog10 (C1_U_RTDAnalog10.2 C2_U_RTDAnalog10.1 U1_U_RTDAnalog10.6), U_RTDAnalog11 (C1_U_RTDAnalog11.2 C2_U_RTDAnalog11.1 U1_U_RTDAnalog11.6), U_RTDAnalog12 (C1_U_RTDAnalog12.2 C2_U_RTDAnalog12.1 U1_U_RTDAnalog12.6), U_ConnectorSch1 (J1_U_ConnectorSch1.3), U_ConnectorSch2 (J1_U_ConnectorSch2.3), U_ConnectorSch3 (J1_U_ConnectorSch3.3), U_ConnectorSch4 (J1_U_ConnectorSch4.3), U_ConnectorSch5 (J1_U_ConnectorSch5.3), U_ConnectorSch6 (J1_U_ConnectorSch6.3), U_ConnectorSch7 (J1_U_ConnectorSch7.3), U_ConnectorSch8 (J1_U_ConnectorSch8.3), U_ConnectorSch9 (J1_U_ConnectorSch9.3), U_ConnectorSch10 (J1_U_ConnectorSch10.3), U_ConnectorSch11 (J1_U_ConnectorSch11.3), U_ConnectorSch12 (J1_U_ConnectorSch12.3), U_ComparisonSch1 (C6_U_ComparisonSch1.2 R6_U_ComparisonSch1.1 U3_U_ComparisonSch1.1), U_ComparisonSch2 (C6_U_ComparisonSch2.2 R6_U_ComparisonSch2.1 U3_U_ComparisonSch2.1), U_ComparisonSch3 (C6_U_ComparisonSch3.2 R6_U_ComparisonSch3.1 U3_U_ComparisonSch3.1), U_ComparisonSch4 (C6_U_ComparisonSch4.2 R6_U_ComparisonSch4.1 U3_U_ComparisonSch4.1), U_ComparisonSch5 (C6_U_ComparisonSch5.2 R6_U_ComparisonSch5.1 U3_U_ComparisonSch5.1), U_ComparisonSch6 (C6_U_ComparisonSch6.2 R6_U_ComparisonSch6.1 U3_U_ComparisonSch6.1), U_ComparisonSch7 (C6_U_ComparisonSch7.2 R6_U_ComparisonSch7.1 U3_U_ComparisonSch7.1), U_ComparisonSch8 (C6_U_ComparisonSch8.2 R6_U_ComparisonSch8.1 U3_U_ComparisonSch8.1), U_ComparisonSch9 (C6_U_ComparisonSch9.2 R6_U_ComparisonSch9.1 U3_U_ComparisonSch9.1), U_ComparisonSch10 (C6_U_ComparisonSch10.2 R6_U_ComparisonSch10.1 U3_U_ComparisonSch10.1), U_ComparisonSch11 (C6_U_ComparisonSch11.2 R6_U_ComparisonSch11.1 U3_U_ComparisonSch11.1), U_ComparisonSch12 (C6_U_ComparisonSch12.2 R6_U_ComparisonSch12.1 U3_U_ComparisonSch12.1)
RTD+1: U_RTDAnalog1 (R2_U_RTDAnalog1.1 U1_U_RTDAnalog1.4), U_ConnectorSch1 (J1_U_ConnectorSch1.1)
RTD+2: U_RTDAnalog2 (R2_U_RTDAnalog2.1 U1_U_RTDAnalog2.4), U_ConnectorSch2 (J1_U_ConnectorSch2.1)
RTD+3: U_RTDAnalog3 (R2_U_RTDAnalog3.1 U1_U_RTDAnalog3.4), U_ConnectorSch3 (J1_U_ConnectorSch3.1)
RTD+4: U_RTDAnalog4 (R2_U_RTDAnalog4.1 U1_U_RTDAnalog4.4), U_ConnectorSch4 (J1_U_ConnectorSch4.1)
RTD+5: U_RTDAnalog5 (R2_U_RTDAnalog5.1 U1_U_RTDAnalog5.4), U_ConnectorSch5 (J1_U_ConnectorSch5.1)
RTD+6: U_RTDAnalog6 (R2_U_RTDAnalog6.1 U1_U_RTDAnalog6.4), U_ConnectorSch6 (J1_U_ConnectorSch6.1)
RTD+7: U_RTDAnalog7 (R2_U_RTDAnalog7.1 U1_U_RTDAnalog7.4), U_ConnectorSch7 (J1_U_ConnectorSch7.1)
RTD+8: U_RTDAnalog8 (R2_U_RTDAnalog8.1 U1_U_RTDAnalog8.4), U_ConnectorSch8 (J1_U_ConnectorSch8.1)
RTD+9: U_RTDAnalog9 (R2_U_RTDAnalog9.1 U1_U_RTDAnalog9.4), U_ConnectorSch9 (J1_U_ConnectorSch9.1)
RTD+10: U_RTDAnalog10 (R2_U_RTDAnalog10.1 U1_U_RTDAnalog10.4), U_ConnectorSch10 (J1_U_ConnectorSch10.1)
RTD+11: U_RTDAnalog11 (R2_U_RTDAnalog11.1 U1_U_RTDAnalog11.4), U_ConnectorSch11 (J1_U_ConnectorSch11.1)
RTD+12: U_RTDAnalog12 (R2_U_RTDAnalog12.1 U1_U_RTDAnalog12.4), U_ConnectorSch12 (J1_U_ConnectorSch12.1)
RTD-1: U_RTDAnalog1 (R4_U_RTDAnalog1.1 R5_U_RTDAnalog1.1), U_ConnectorSch1 (J1_U_ConnectorSch1.2)
RTD-2: U_RTDAnalog2 (R4_U_RTDAnalog2.1 R5_U_RTDAnalog2.1), U_ConnectorSch2 (J1_U_ConnectorSch2.2)
RTD-3: U_RTDAnalog3 (R4_U_RTDAnalog3.1 R5_U_RTDAnalog3.1), U_ConnectorSch3 (J1_U_ConnectorSch3.2)
RTD-4: U_RTDAnalog4 (R4_U_RTDAnalog4.1 R5_U_RTDAnalog4.1), U_ConnectorSch4 (J1_U_ConnectorSch4.2)
RTD-5: U_RTDAnalog5 (R4_U_RTDAnalog5.1 R5_U_RTDAnalog5.1), U_ConnectorSch5 (J1_U_ConnectorSch5.2)
RTD-6: U_RTDAnalog6 (R4_U_RTDAnalog6.1 R5_U_RTDAnalog6.1), U_ConnectorSch6 (J1_U_ConnectorSch6.2)
RTD-7: U_RTDAnalog7 (R4_U_RTDAnalog7.1 R5_U_RTDAnalog7.1), U_ConnectorSch7 (J1_U_ConnectorSch7.2)
RTD-8: U_RTDAnalog8 (R4_U_RTDAnalog8.1 R5_U_RTDAnalog8.1), U_ConnectorSch8 (J1_U_ConnectorSch8.2)
RTD-9: U_RTDAnalog9 (R4_U_RTDAnalog9.1 R5_U_RTDAnalog9.1), U_ConnectorSch9 (J1_U_ConnectorSch9.2)
RTD-10: U_RTDAnalog10 (R4_U_RTDAnalog10.1 R5_U_RTDAnalog10.1), U_ConnectorSch10 (J1_U_ConnectorSch10.2)
RTD-11: U_RTDAnalog11 (R4_U_RTDAnalog11.1 R5_U_RTDAnalog11.1), U_ConnectorSch11 (J1_U_ConnectorSch11.2)
RTD-12: U_RTDAnalog12 (R4_U_RTDAnalog12.1 R5_U_RTDAnalog12.1), U_ConnectorSch12 (J1_U_ConnectorSch12.2)
Vref1: U_RTDAnalog1 (R1_U_RTDAnalog1.2 R2_U_RTDAnalog1.2), U_RTDAnalog2 (R1_U_RTDAnalog2.2 R2_U_RTDAnalog2.2), U_RTDAnalog3 (R1_U_RTDAnalog3.2 R2_U_RTDAnalog3.2), U_RTDAnalog4 (R1_U_RTDAnalog4.2 R2_U_RTDAnalog4.2), U_RTDAnalog5 (R1_U_RTDAnalog5.2 R2_U_RTDAnalog5.2), U_RTDAnalog6 (R1_U_RTDAnalog6.2 R2_U_RTDAnalog6.2), U_VrefSch1 (C5_U_VrefSch1.2 U2_U_VrefSch1.6)
Vref2: U_VrefSch2 (C5_U_VrefSch2.2 U2_U_VrefSch2.6), U_RTDAnalog7 (R1_U_RTDAnalog7.2 R2_U_RTDAnalog7.2), U_RTDAnalog8 (R1_U_RTDAnalog8.2 R2_U_RTDAnalog8.2), U_RTDAnalog9 (R1_U_RTDAnalog9.2 R2_U_RTDAnalog9.2), U_RTDAnalog10 (R1_U_RTDAnalog10.2 R2_U_RTDAnalog10.2), U_RTDAnalog11 (R1_U_RTDAnalog11.2 R2_U_RTDAnalog11.2), U_RTDAnalog12 (R1_U_RTDAnalog12.2 R2_U_RTDAnalog12.2)
Vref3: U_VrefSch3 (C5_U_VrefSch3.2 U2_U_VrefSch3.6), U_ComparisonSch1 (R6_U_ComparisonSch1.3), U_ComparisonSch2 (R6_U_ComparisonSch2.3), U_ComparisonSch3 (R6_U_ComparisonSch3.3), U_ComparisonSch4 (R6_U_ComparisonSch4.3), U_ComparisonSch5 (R6_U_ComparisonSch5.3), U_ComparisonSch6 (R6_U_ComparisonSch6.3), U_ComparisonSch7 (R6_U_ComparisonSch7.3), U_ComparisonSch8 (R6_U_ComparisonSch8.3), U_ComparisonSch9 (R6_U_ComparisonSch9.3), U_ComparisonSch10 (R6_U_ComparisonSch10.3), U_ComparisonSch11 (R6_U_ComparisonSch11.3), U_ComparisonSch12 (R6_U_ComparisonSch12.3)
Vrtd1: U_RTDAnalog1 (U1_U_RTDAnalog1.7), U_ComparisonSch1 (U3_U_ComparisonSch1.3)
Vrtd2: U_RTDAnalog2 (U1_U_RTDAnalog2.7), U_ComparisonSch2 (U3_U_ComparisonSch2.3)
Vrtd3: U_RTDAnalog3 (U1_U_RTDAnalog3.7), U_ComparisonSch3 (U3_U_ComparisonSch3.3)
Vrtd4: U_RTDAnalog4 (U1_U_RTDAnalog4.7), U_ComparisonSch4 (U3_U_ComparisonSch4.3)
Vrtd5: U_RTDAnalog5 (U1_U_RTDAnalog5.7), U_ComparisonSch5 (U3_U_ComparisonSch5.3)
Vrtd6: U_RTDAnalog6 (U1_U_RTDAnalog6.7), U_ComparisonSch6 (U3_U_ComparisonSch6.3)
Vrtd7: U_RTDAnalog7 (U1_U_RTDAnalog7.7), U_ComparisonSch7 (U3_U_ComparisonSch7.3)
Vrtd8: U_RTDAnalog8 (U1_U_RTDAnalog8.7), U_ComparisonSch8 (U3_U_ComparisonSch8.3)
Vrtd9: U_RTDAnalog9 (U1_U_RTDAnalog9.7), U_ComparisonSch9 (U3_U_ComparisonSch9.3)
Vrtd10: U_RTDAnalog10 (U1_U_RTDAnalog10.7), U_ComparisonSch10 (U3_U_ComparisonSch10.3)
Vrtd11: U_RTDAnalog11 (U1_U_RTDAnalog11.7), U_ComparisonSch11 (U3_U_ComparisonSch11.3)
Vrtd12: U_RTDAnalog12 (U1_U_RTDAnalog12.7), U_ComparisonSch12 (U3_U_ComparisonSch12.3)